# Altium project Portolan_Buck_Boost_V2.PrjPcb
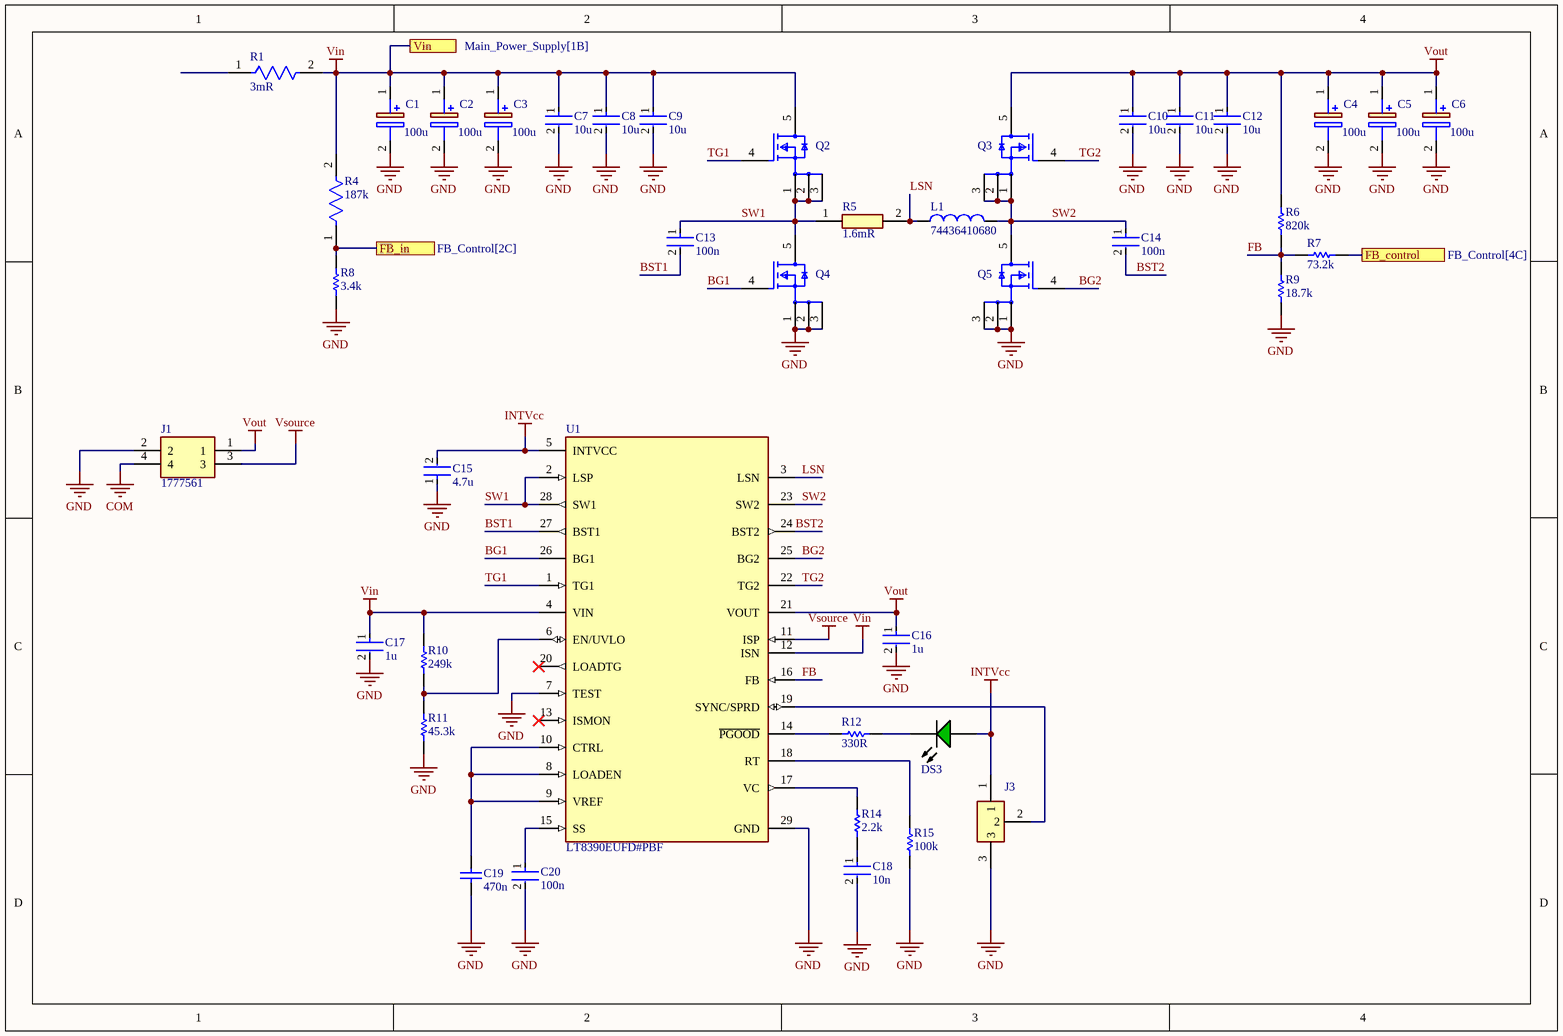
[diagram p0: Power_Stage.SchDoc]
3 sheets, 107 parts. Net scope: flat (ports and power ports of the same name join across sheets).
Board file: Buck_Boost_Converter.PcbDoc
Sheets:
  Power_Stage.SchDoc
  Main_Power_Supply.SchDoc
  FB_Control.SchDoc

## Sheet Power_Stage.SchDoc
size A4; SheetNumber: 1; SheetTotal: 3

### Parts
C1  value 100u  [CAPPRD500W65D1025H1700]  (hidden comment: ECA-2AM101B)
C2  value 100u  [CAPPRD500W65D1025H1700]  (hidden comment: ECA-2AM101B)
C3  value 100u  [CAPPRD500W65D1025H1700]  (hidden comment: ECA-2AM101B)
C4  value 100u  [CAPPRD500W65D1025H1700]  (hidden comment: ECA-2AM101B)
C5  value 100u  [CAPPRD500W65D1025H1700]  (hidden comment: ECA-2AM101B)
C6  value 100u  [CAPPRD500W65D1025H1700]  (hidden comment: ECA-2AM101B)
C7  10u  [FP-GRM32E-0_3-0_2-MFG]
C8  10u  [FP-GRM32E-0_3-0_2-MFG]
C9  10u  [FP-GRM32E-0_3-0_2-MFG]
C10  10u  [FP-GRM32E-0_3-0_2-MFG]
C11  10u  [FP-GRM32E-0_3-0_2-MFG]
C12  10u  [FP-GRM32E-0_3-0_2-MFG]
C13  100n  [FP-0805-L_2_01_0_2-W_1_25-MFG]
C14  100n  [FP-0805-L_2_01_0_2-W_1_25-MFG]
C15  4.7u  [FP-0805-L_2_01_0_2-W_1_25-IPC_A]
C16  1u  [FP-1210-L_3_3_0_4-W_2_5_0-IPC_C]
C17  1u  [FP-1210-L_3_3_0_4-W_2_5_0-IPC_C]
C18  10n  [FP-0805-L_2_01_0_2-W_1_25-IPC_B]
C19  470n  [CAPC2013X140X50ML20T25]
C20  100n  [FP-0805-L_2_01_0_2-W_1_25-MFG]
DS3  LTST-C170KGKT  [LTST-LTST-C170KGKT-2_V]  (value not drawn)
J1  1777561  [1777561]
J3  22-28-4030  [MOLEX_22-28-4030]  (value not drawn)
L1  74436410680  [WE-HCF_2815]
Q2  NVMYS3D3N06CLTWG  [FP-760AB-MFG]  (value not drawn)
Q3  NVMYS3D3N06CLTWG  [FP-760AB-MFG]  (value not drawn)
Q4  NVMYS3D3N06CLTWG  [FP-760AB-MFG]  (value not drawn)
Q5  NVMYS3D3N06CLTWG  [FP-760AB-MFG]  (value not drawn)
R1  3mR  [FP-CSS2H-3920K-3L00FE-MFG]
R4  187k  [FP-ERJ3EK-MFG]
R5  value 1.6mR  [RESC6432X89N]  (hidden comment: WSLP25121L600FEA)
R6  820k  [RESC1608X55X30ML15T15]
R7  73.2k  [RESC1005X40X25LL05T05]
R8  3.4k  [RESC1608X55X30LL15T15]
R9  18.7k  [RESC1608X55X30LL15T15]
R10  249k  [RESC1608X55X30ML15T15]
R11  45.3k  [RESC1608X55X30ML15T15]
R12  330R  [RESC1608X55X30LL15T15]
R14  2.2k  [RESC1608X55X30LL15T15]
R15  100k  [RESC1608X55X30ML15T15]
U1  LT8390EUFD#PBF  [FP-UFD-28-05-08-1712-MFG]

### Ports
FB_control (see FB_Control[4C]), FB_in (see FB_Control[2C]), Vin (see Main_Power_Supply[1B])

### Nets
COM: J1.4
GND: C1.2(-) C2.2(-) C3.2(-) C4.2(-) C5.2(-) C6.2(-) C7.2 C8.2 C9.2 C10.2 C11.2 C12.2 C15.1 C16.2 C17.2 C18.2 C19.1 C20.2 J1.2 J3.3 Q4.1(S) Q4.2(S) Q4.3(S) Q5.1(S) Q5.2(S) Q5.3(S) R8.1 R9.1 R11.1 R15.2 U1.7(TEST) U1.29(GND)
INTVcc: C15.2 DS3.2(A) J3.1 U1.5(INTVCC)
Vin: C1.1(+) C2.1(+) C3.1(+) C7.1 C8.1 C9.1 C17.1 Q2.5(D) R1.2 R4.2 R10.2 U1.4(VIN) U1.12(ISN) ; port Vin
Vout: C4.1(+) C5.1(+) C6.1(+) C10.1 C11.1 C12.1 C16.1 J1.1 Q3.5(D) R6.2 U1.21(VOUT)
Vsource: J1.3 U1.11(ISP)
BG1: Q4.4(G) U1.26(BG1)
BG2: Q5.4(G) U1.25(BG2)
BST1: C13.2 U1.27(BST1)
BST2: C14.2 U1.24(BST2)
FB: R6.1 R7.1 R9.2 U1.16(FB)
LSN: L1.1 R5.2 U1.3(LSN)
SW1: C13.1 Q2.1(S) Q2.2(S) Q2.3(S) Q4.5(D) R5.1 U1.2(LSP) U1.28(SW1)
SW2: C14.1 L1.2 Q3.1(S) Q3.2(S) Q3.3(S) Q5.5(D) U1.23(SW2)
TG1: Q2.4(G) U1.1(TG1)
TG2: Q3.4(G) U1.22(TG2)
NetC18_1: C18.1 R14.1
NetC19_2: C19.2 U1.8(LOADEN) U1.9(VREF) U1.10(CTRL)
NetC20_1: C20.1 U1.15(SS)
NetDS3_1: DS3.1(K) R12.1
NetJ3_2: J3.2 U1.19(SYNC/SPRD)
NetJ7_2: R7.2 ; port FB_control
NetR4_1: R4.1 R8.2 ; port FB_in
NetR10_1: R10.1 R11.2 U1.6(EN/UVLO)
NetR12_2: R12.2 U1.14(~{PGOOD})
NetR14_2: R14.2 U1.17(VC)
NetR15_1: R15.1 U1.18(RT)

Not connected (* = marked no-connect by the designer): R1 1; U1 13(ISMON)* 20(LOADTG)*

### Library data of the parts
C1-C6 = ECA-2AM101B: Aluminium Electrolytic Capacitors 100uF 100V - Radial Leaded Al Lytic Cap 85C Radial M Series; Manufacturer_Name: Panasonic; Datasheet Link: http://industrial.panasonic.com/cdbs/www-data/pdf/RDF0000/ABA0000C1218.pdf; Height: 17mm; Manufacturer_Part_Number: ECA-2AM101B; Mouser Part Number: 667-ECA-2AM101B; Mouser Price/Stock: https://www.mouser.co.uk/ProductDetail/Panasonic/ECA-2AM101B?qs=ncxkyCpAYDDPznZ5ZfVZ2w%3D%3D; Arrow Part Number: ECA-2AM101B; Arrow Price/Stock: https://www.arrow.com/en/products/eca-2am101b/panasonic?region=nac
C7-C12 = CMP-06035-000081-2: Chip Multilayer Ceramic Capacitors for General Purpose, 1210, 10uF, X7S, 22%, 10%, 100V; Case Code (Metric): 3225; Case/Package: 1210; Case Code (Imperial): 1210; Voltage Rating: 100V; Capacitance: 10uF; Packaging: Tape and Reel; Mount: Surface Mount; Min Operating Temperature: -55°C; Max Operating Temperature: 125°C; Tolerance: 10%
C13 C14 C20 = CMP-2000-05808-2: General Purpose Ceramic Capacitor, 0805, 100nF, 5%, X7R, 0.15, 50V; Dissipation Factor: 2.5%; Insulation Resistance: 100GR; Length: 2.01mm; Min Operating Temperature: -55°C; Number of Pins: 2; Width: 0.049inch; Height: 0.94mm; Max Operating Temperature: 125°C; RoHS Compliant: Yes; Depth: 1.25mm; Radiation Hardening: No; Case Code (Metric): 2012; Case/Package: 0805; Contact Plating: Tin; Mount: Surface Mount; Tolerance: 5%; Dielectric Material: Ceramic; Case Code (Imperial): 0805; Capacitance: 100nF; Dielectric: X7R; Voltage Rating: 50V; REACH SVHC: No SVHC; Thickness: 0.037inch; Voltage Rating (DC): 50V; Lead Free: Lead Free; Package Quantity: 1; Packaging: Tape and Reel; Voltage: 50V; Termination: SMD/SMT
C15 = CMP-1036-04881-3: General Purpose Ceramic Capacitor, 0805, 4.7uF, 10%, X5R, 0.15, 10V; Min Operating Temperature: -55°C; RoHS Compliant: Yes; Dielectric: X5R; Lead Free: Lead Free; Radiation Hardening: No; Depth: 1.25mm; Case Code (Metric): 2012; Weight: 0.000194oz; Packaging: Tape and Reel; Voltage Rating: 10V; Capacitance: 4.7uF; Number of Pins: 2; Voltage: 10V; Construction: Flat; Length: 2.01mm; Case Code (Imperial): 0805; Package Quantity: 1; Voltage Rating (DC): 10V; Height: 1.4mm; Termination: SMD/SMT; Tolerance: 10%; REACH SVHC: No SVHC; Mount: Surface Mount; Width: 1.25mm; Max Operating Temperature: 85°C; Case/Package: 0805; Series: -; Thickness: 0.055inch
C16 C17 = CMP-2000-05475-2: General Purpose Ceramic Capacitor, 1210, 1uF, 10%, X7R, 15%, 100V; Tolerance: 20%; Dissipation Factor: 2.5%; Voltage Rating (DC): 100V; Series: -; Voltage Rating: 100V; Max Operating Temperature: 125°C; Radiation Hardening: No; Length: 3.2mm; Mount: Surface Mount; Termination: SMD/SMT; Voltage: 100V; RoHS Compliant: Yes; Case/Package: 1210; Thickness: 0.11inch; REACH SVHC: No SVHC; Lead Free: Lead Free; Height: 2.79mm; Case Code (Imperial): 1210; Contact Plating: Tin; Case Code (Metric): 3225; Min Operating Temperature: -55°C; Construction: Flat; Capacitance: 1uF; Depth: 2.5mm; Dielectric: X7R; Package Quantity: 1; Packaging: Tape and Reel; Width: 2.5mm
C18 = CMP-2007-04361-2: General Purpose Ceramic Capacitor, 0805, 10nF, 5%, X7R, 0.15, 50V; Insulation Resistance: 100GR; Dissipation Factor: 2.5%; Series: -; Case Code (Imperial): 0805; Voltage Rating (DC): 50V; Dielectric: X7R; Voltage Rating: 50V; Lead Free: Lead Free; Max Operating Temperature: 125°C; Depth: 1.25mm; Termination: SMD/SMT; Number of Pins: 2; Dielectric Material: Ceramic; Capacitance: 10nF; Case/Package: 0805; Contact Plating: Tin; Mount: Surface Mount; Height: 0.71mm; Package Quantity: 1; Packaging: Tape and Reel; Construction: Flat; RoHS Compliant: Yes; Voltage: 50V; Case Code (Metric): 2012; REACH SVHC: No SVHC; Tolerance: 5%; Radiation Hardening: No; Width: 0.049inch; Thickness: 0.037inch; Length: 2.01mm; Min Operating Temperature: -55°C
C19 = CMP-2007-04634-1: Manufacturer: AVX Interconnect / Elco; Part Number: 08055C474JAT2A
DS3 = CMP-2000-06620-1: Ultra Bright AlInGaP Chip LED, 75 mW, -55 to 85 degC, 2-Pin SMD (0805), RoHS, Tape and Reel; Manufacturer: Lite-On; Forward Current: 30mA; Power Dissipation Max: 75mW; Emitting Color: YellowGreen; Type: Uni-Color; Forward Voltage: 2.4V; Dominant Wave Length: 571nm; Test Current (It): 20mA; Product Length (mm): 2mm; Peak Wavelength: 574nm; Power Dissipation: 75W; Product Depth (mm): 1.25mm; DELETED: Compliant; High Brightness: Yes; Product Height (mm): 1.1mm; Luminous Intensity: 35mcd; Shape Type: Rectangular; Chip Material: AlGaInP; Viewing Angle: 130deg; Number of  Elements: 1; Reverse Voltage: 5V; Rad Hardened: No; Package Type: ChipLed; Manufacturer URL: http://www.us.liteon.com/; Mounting: SurfaceMount; Operating Temp Range: -55Cto85C; Datasheet URL: http://optoelectronics.liteon.com/upload/download/DS22-2000-073/S_110_LTST-C170KGKT.pdf; Packaging: TapeandReel; Pin Count: 2; Package Description: 2-Pin Surface Mounted Device, Body 2 x 1.25 mm; Mounting Technology: SurfaceMount; Package Reference: LTST-C170KGKT-2; Forward Current Max: 30mA; Datasheet Version: Rev. G, 06/2005; Lens Dimensions: 1.4x1.25x0.6mm; Operating Temperature Classification: Industrial; Lum Intensity: 35mcd; Main Category: ChipLED
J1 = 1777561: Connector; Manufacturer_Name: Phoenix Contact; Datasheet Link: https://www.digikey.com/en/products/detail/phoenix-contact/1777561/4453071?s=N4IgTCBcDaIIwHYkFYBscQF0C%2BQ; Height: 27.2mm; Manufacturer_Part_Number: 1777561; Mouser Part Number: 651-1777561; Mouser Price/Stock: https://www.mouser.co.uk/ProductDetail/Phoenix-Contact/1777561?qs=eS454NpRRZHLxN8tVDEUWQ%3D%3D; Arrow Part Number: 1777561; Arrow Price/Stock: https://www.arrow.com/en/products/1777561/phoenix-contact?region=nac
J3 = 22-28-4030: Connector Header Through Hole 3 position 0.100" (2.54mm); Package: None; Price: None; Value: *; MP: 22-28-4030; Availability: Unavailable
L1 = CMP-03913-84285494-2: 74436410680 Inductor, high current, 6.8uH, 1.44mOhm, 27mmL x 28mmW x 15.4mmH, SMT; Inductance: 6.8µH; Saturation Current: 30A; DC Resistance (DCR): 1.31mΩ; Inductance Tolerance: 15%; Ambient Temperature Range High: 75°C; Length: 27mm; NexarPartId: 84285494; Height: 15.4mm; Min Operating Temperature: -40°C; Ambient Temperature Range Low: -40°C; Max Operating Temperature: 125°C; Number of Pins: 2; RoHS: Compliant; Width: 28mm
Q2-Q5 = CMP-00278-99684032-1: NVMYS3D3N06CLTWG Single Mosfet Transistors Rohs Compliant: Yes; Manufacturer Lifecycle Status: ACTIVE; Turn-On Delay Time: 15ns; Drain to Source Resistance: 2.6mΩ; Gate to Source Voltage (Vgs): 20V; Number of Channels: 1; Max Junction Temperature (Tj): 175°C; Drain to Source Breakdown Voltage: 60V; Turn-Off Delay Time: 66ns; Continuous Drain Current (ID): 26A; Power Dissipation: 3.9W; NexarPartId: 99684032; Min Operating Temperature: -55°C; RoHS: Compliant; Drain to Source Voltage (Vdss): 60V; Lifecycle Status: Production; Max Operating Temperature: 175°C; Height: 1.3mm
R1 = CMP-07231-007409-1: RES 0.003 OHM 1% 5W 3920; Temperature Coefficient: 50ppm/°C; Max Power Dissipation: 5W; Resistor Type: Metal Element; RoHS Compliant: Yes; Case/Package: 3920; Tolerance: 1%; Packaging: Tape and Reel; Features: Moisture Resistant; Series: CSS2H-3920; Resistance: 3mR; Min Operating Temperature: -55°C; Number of Terminations: 2; Max Operating Temperature: 170°C
R4 = CMP-2000-00305-2: RES SMD 187K OHM 1% 1/10W 0603; Temperature Coefficient: 100ppm/°C; Max Power Dissipation: 100mW; Voltage Rating (DC): 50V; Resistance: 187kR; Voltage Rating: 75V; Packaging: Tape and Reel; Height: 0.45mm; Mount: Surface Mount; Min Operating Temperature: -55°C; Contact Plating: Tin; Radiation Hardening: No; Case/Package: 0603; Technology: THICK FILM; Resistor Type: Thick Film; Features: Automotive AEC-Q200; Length: 1.6mm; REACH SVHC: Yes; Construction: Rectangular; Max Operating Temperature: 155°C; Military Standard: Not; Case Code (Imperial): 0603; RoHS Compliant: Yes; Package Quantity: 1; Power Rating: 100mW; Termination: SMD/SMT; Resistance Tolerance: 1%; Number of Terminations: 2; Case Code (Metric): 1608; Depth: 0.8mm; Series: ERJ; Tolerance: 1%; Width: 0.8mm; Lead Free: Lead Free
R5 = WSLP25121L600FEA: Current Sense Resistors - SMD 3watt .0016ohm 1%; Manufacturer_Name: Vishay; Datasheet Link: https://www.vishay.com/docs/30122/wslp.pdf; Height: 0.889mm; Manufacturer_Part_Number: WSLP25121L600FEA
R6 = CMP-2000-00657-1: Manufacturer: Panasonic; Part Number: ERJ3EKF8203V
R7 = CMP-2002-01054-1: Part Number: ERJ-2RKF7322X; Manufacturer: Panasonic
R8 = CMP-2000-00446-1: Part Number: ERJ-3EKF3401V; Manufacturer: Panasonic
R9 = CMP-2000-00304-1: Part Number: ERJ-3EKF1872V; Manufacturer: Panasonic
R10 = CMP-2000-00371-1: Part Number: ERJ-3EKF2493V; Manufacturer: Panasonic
R11 = CMP-1012-00697-2: Manufacturer: Panasonic; Part Number: ERJ-3EKF4532V
R12 = CMP-2000-00435-2: Chip Resistor, 330 Ohm, +/- 1%, 0.1 W, -55 to 155 degC, 0603 (1608 Metric), RoHS, Tape and Reel; Gender: Male; Mating Cycles: 10000; Current Rating: 500 mA; Voltage Rating: 10 V; REACH SVHC: No SVHC; PackageDescription: 2-Pin Surface Mount Device, Body 1.6 x 0.85 mm; Contact Finish: Gold; Pins: 8; ComponentLink1Description: Manufacturer URL; Packaging: Tape and Reel; Max Operating Temperature: 85 degC; Contact Material: Copper; Height: 1.45 mm; Width: 1.45 mm; DatasheetVersion: Apr-15; Package Quantity: 1500; Contact Plating: Gold; PackageReference: 0603; Mount: Surface Mount; Lead Pitch: 1.1 mm; Min Operating Temperature: -25 degC; ComponentLink1URL: http://www.panasonic.com/; ComponentLink2URL: http://industrial.panasonic.com/cdbs/www-data/pdf/RDA0000/AOA0000C86.pdf; Length: 13.7 mm; ComponentLink2Description: Datasheet; RoHSCompliant: true
R14 = CMP-2000-00336-1: Part Number: ERJ3EKF2201V; Manufacturer: Panasonic
R15 = CMP-2000-00182-1: Part Number: ERJ-3EKF1003V; Manufacturer: Panasonic
U1 = CMP-09139-000027-1: IC REG CTRLR BUCK/BOOST 28QFN; Number of Output Phases: 1; Max Supply Voltage: 60V; Min Supply Voltage: 4V; Switching Frequency: 630kHz; Synchronous Rectifier: Yes; Topology: Buck-Boost; Max Duty Cycle: 95%; Output Configuration: Positive; Case/Package: QFN; Min Operating Temperature: -40°C; REACH SVHC: No SVHC; Number of Pins: 28; Max Operating Temperature: 125°C; Clock Sync: Yes; Number of Outputs: 1

## Sheet Main_Power_Supply.SchDoc
size A4; SheetNumber: 2; SheetTotal: 3
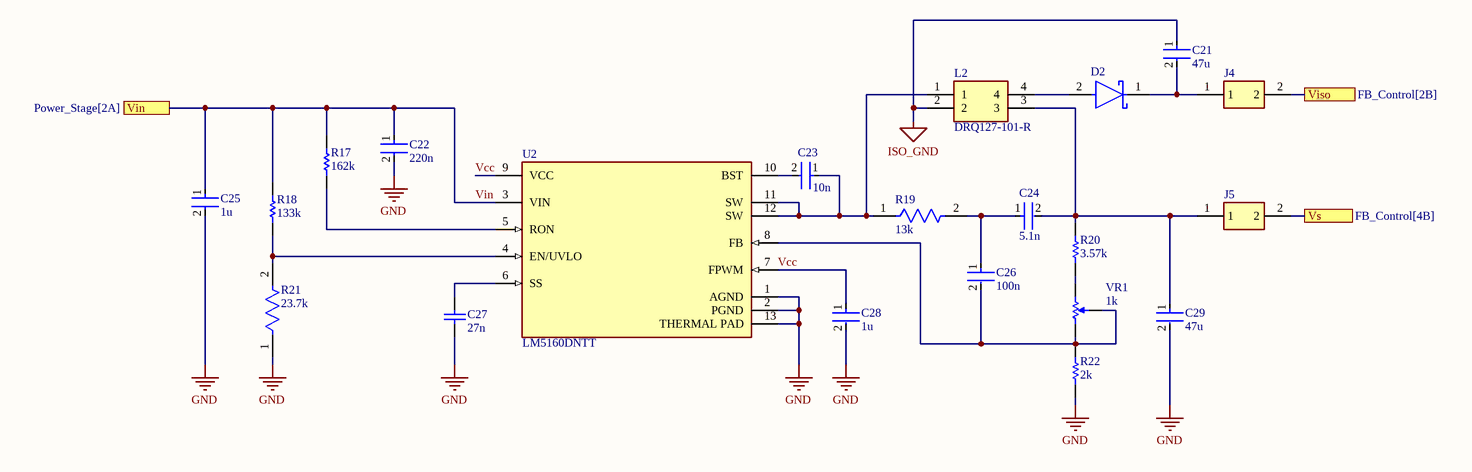
[diagram p1: Main_Power_Supply.SchDoc]

### Parts
C21  47u  [FP-GRM32E-0_3-0_2-IPC_A]
C22  220n  [FP-GRM21A-0_1-MFG]
C23  10n  [FP-0805-L_2_01_0_2-W_1_25-IPC_B]
C24  5.1n  [FP-GRM219-0_1-IPC_A]
C25  1u  [FP-1210-L_3_3_0_4-W_2_5_0-IPC_C]
C26  100n  [FP-0805-L_2_01_0_2-W_1_25-MFG]
C27  27n  [CAPC1005X56X25LL10T15]
C28  1u  [FP-1210-L_3_3_0_4-W_2_5_0-IPC_C]
C29  47u  [FP-GRM32E-0_3-0_2-IPC_A]
D2  MBR230LSFT1G  [FP-498-MFG]  (value not drawn)
J4  22-28-4020  [MOLEX_22-28-4020]  (value not drawn)
J5  22-28-4020  [MOLEX_22-28-4020]  (value not drawn)
L2  DRQ127-101-R  [DRQ127101R]
R17  162k  [RESC1608X55X30ML15T15]
R18  133k  [RESC1608X55X30LL15T15]
R19  13k  [FP-ERJ3EK-IPC_C]
R20  3.57k  [RESC1608X55X30LL15T15]
R21  23.7k  [FP-ERJ3EK-IPC_C]
R22  2k  [RESC1608X55X30ML15T15]
U2  LM5160DNTT  [FP-DNT0012B-MFG]
VR1  1k  [BOUR-3296W-1-3]

### Ports
Vin (see Power_Stage[2A]), Viso (see FB_Control[2B]), Vs (see FB_Control[4B])

### Nets
GND: C22.2 C25.2 C27.1 C28.2 C29.2 R21.1 R22.1 U2.1(AGND) U2.2(PGND) U2.13(THERMAL_PAD)
ISO_GND: C21.1 L2.2
Vin: C22.1 C25.1 R17.2 R18.2 U2.3(VIN) ; port Vin
Viso: J4.2 ; port Viso
Vs: J5.2 ; port Vs
Vcc: C28.1 U2.7(FPWM) U2.9(VCC)
NetC21_2: C21.2 D2.1(C) J4.1
NetC23_1: C23.1 L2.1 R19.1 U2.11(SW) U2.12(SW)
NetC23_2: C23.2 U2.10(BST)
NetC24_1: C24.1 C26.1 R19.2
NetC24_2: C24.2 C29.1 J5.1 L2.3 R20.2
NetC26_2: C26.2 R22.2 U2.8(FB) VR1.1(A) VR1.3(TAP)
NetC27_2: C27.2 U2.6(SS)
NetD2_2: D2.2(A) L2.4
NetR17_1: R17.1 U2.5(RON)
NetR18_1: R18.1 R21.2 U2.4(EN/UVLO)
NetR20_1: R20.1 VR1.2(B)

### Library data of the parts
C21 C29 = CMP-06035-017875-1: Chip Multilayer Ceramic Capacitors for General Purpose, 1210, 47uF, X6S, 22%, 10%, 16V; Thickness: 2.5mm; Capacitance: 47uF; Length: 3.2mm; Dielectric: X6S; Width: 2.5mm; Case/Package: 1210; Tolerance: 10%; Voltage Rating (DC): 16V
C22 = CMP-1036-04561-4: CAP CER 0.22UF 100V X7R 0805; Material: Ceramic; Tolerance: 10%; Capacitance: 220nF; Radiation Hardening: No; Case Code (Imperial): 0805; Height: 1mm; Length: 2mm; Case/Package: 0805; Packaging: Tape and Reel; Case Code (Metric): 2012; Thickness: 0.039inch; Voltage Rating (DC): 100V; Width: 1.25mm; Max Operating Temperature: 125°C; Voltage: 100V; Dielectric: X7R; Mount: Surface Mount; Package Quantity: 3000; Voltage Rating: 100V; REACH SVHC: No SVHC; Depth: 1.25mm; Min Operating Temperature: -55°C; Termination: SMD/SMT; Lead Free: Lead Free
C23 = CMP-2007-04361-2: as C18 on sheet Power_Stage; Series: -; Case Code (Imperial): 0805; Voltage Rating (DC): 50V; Dielectric: X7R; Voltage Rating: 50V; Lead Free: Lead Free; Max Operating Temperature: 125°C; Depth: 1.25mm; Termination: SMD/SMT; Number of Pins: 2; Dielectric Material: Ceramic; Capacitance: 10nF; Case/Package: 0805; Contact Plating: Tin; Mount: Surface Mount; Height: 0.71mm; Package Quantity: 1; Packaging: Tape and Reel; Construction: Flat; RoHS Compliant: Yes; Voltage: 50V; Case Code (Metric): 2012; REACH SVHC: No SVHC; Tolerance: 5%; Radiation Hardening: No; Width: 0.049inch; Thickness: 0.037inch; Length: 2.01mm; Min Operating Temperature: -55°C
C24 = CMP-2007-00142-2: Chip Multilayer Ceramic Capacitors for General Purpose, 0805, 5100pF, C0G, 30ppm/°C, 5%, 50V; Capacitance: 5.1nF; Min Operating Temperature: -55°C; Voltage Rating (DC): 50V; Radiation Hardening: No; Case/Package: 0805; Depth: 1.25mm; Case Code (Imperial): 0805; Voltage: 50V; Lead Free: Lead Free; Mount: Surface Mount; Packaging: Tape and Reel; Width: 0.049inch; Height: 0.85mm; Length: 2mm; Voltage Rating: 50V; Thickness: 0.037inch; Package Quantity: 1; Tolerance: 5%; Max Operating Temperature: 125°C; Case Code (Metric): 2012; Termination: SMD/SMT; Dielectric: C0G
C25 C28 = CMP-2000-05475-2: as C16 on sheet Power_Stage; Voltage Rating (DC): 100V; Series: -; Voltage Rating: 100V; Max Operating Temperature: 125°C; Radiation Hardening: No; Length: 3.2mm; Mount: Surface Mount; Termination: SMD/SMT; Voltage: 100V; RoHS Compliant: Yes; Case/Package: 1210; Thickness: 0.11inch; REACH SVHC: No SVHC; Lead Free: Lead Free; Height: 2.79mm; Case Code (Imperial): 1210; Contact Plating: Tin; Case Code (Metric): 3225; Min Operating Temperature: -55°C; Construction: Flat; Capacitance: 1uF; Depth: 2.5mm; Dielectric: X7R; Package Quantity: 1; Packaging: Tape and Reel; Width: 2.5mm
C26 = CMP-2000-05808-2: as C13 on sheet Power_Stage; Length: 2.01mm; Min Operating Temperature: -55°C; Number of Pins: 2; Width: 0.049inch; Height: 0.94mm; Max Operating Temperature: 125°C; RoHS Compliant: Yes; Depth: 1.25mm; Radiation Hardening: No; Case Code (Metric): 2012; Case/Package: 0805; Contact Plating: Tin; Mount: Surface Mount; Tolerance: 5%; Dielectric Material: Ceramic; Case Code (Imperial): 0805; Capacitance: 100nF; Dielectric: X7R; Voltage Rating: 50V; REACH SVHC: No SVHC; Thickness: 0.037inch; Voltage Rating (DC): 50V; Lead Free: Lead Free; Package Quantity: 1; Packaging: Tape and Reel; Voltage: 50V; Termination: SMD/SMT
C27 = CMP-2008-02846-1: Part Number: 0402YD273KAT2A; Manufacturer: AVX Interconnect / Elco
D2 = CMP-1055-00442-2: DIODE SCHOTTKY 30V 2A SOD123L; Max Forward Surge Current (Ifsm): 40A; Element Configuration: Single; Forward Voltage: 430mV; Peak Reverse Current: 1mA; Max Reverse Voltage (DC): 30V; Max Operating Temperature: 125°C; Max Repetitive Reverse Voltage (Vrrm): 30V; Forward Current: 2A; Package Quantity: 1; Height: 0.9mm; REACH SVHC: No SVHC; Contact Plating: Tin; Min Operating Temperature: -55°C; Lead Free: Lead Free; Average Rectified Current: 2A; Halogen Free: Halogen Free; Peak Non-Repetitive Surge Current: 40A; Radiation Hardening: No; Case/Package: SOD; Number of Pins: 2; Packaging: Tape and Reel; Width: 1.8mm; Length: 2.9mm
J4 J5 = 22-28-4020: Connector Header Through Hole 2 position 0.100 (2.54mm); MF: Molex; MP: 22-28-4020; Purchase-URL: https://pricing.snapeda.com/search/part/22-28-4020/?ref=eda; Availability: In Stock; SnapEDA_Link: https://www.snapeda.com/parts/22-28-4020/Molex/view-part/?ref=snap; Package: None; Check_prices: https://www.snapeda.com/parts/22-28-4020/Molex/view-part/?ref=eda; Value: *; Price: None
L2 = DRQ127-101-R: Inductor; Manufacturer_Name: Eaton; Datasheet Link: https://www.eaton.com/content/dam/eaton/products/electronic-components/resources/data-sheet/eaton-drq-shielded-drum-core-power-inductors-data-sheet.pdf; Height: 8mm; Manufacturer_Part_Number: DRQ127-101-R; Mouser Part Number: 704-DRQ127-101-R; Mouser Price/Stock: https://www.mouser.co.uk/ProductDetail/Coiltronics-Eaton/DRQ127-101-R?qs=yzwxPInThYRNK3mQinvZTQ%3D%3D; Arrow Part Number: DRQ127-101-R; Arrow Price/Stock: https://www.arrow.com/en/products/drq127-101-r/eaton
R17 = CMP-1012-00758-2: Manufacturer: Panasonic; Part Number: ERJ-3EKF1623V
R18 = CMP-2000-00239-1: Manufacturer: Panasonic; Part Number: ERJ-3EKF1333V
R19 = CMP-2000-00233-2: RES SMD 13K OHM 1% 1/10W 0603; Voltage Rating (DC): 50V; Max Power Dissipation: 100mW; Voltage Rating: 75V; Resistance: 13kR; Temperature Coefficient: 100ppm/°C; REACH SVHC: No SVHC; Contact Plating: Tin; Case/Package: 0603; Length: 1.6mm; Case Code (Metric): 1608; Construction: Rectangular; Case Code (Imperial): 0603; Termination: SMD/SMT; Power Rating: 100mW; Weight: 7.1E-05oz; Package Quantity: 1; Packaging: Tape and Reel; Mount: Surface Mount; Resistance Tolerance: 1%; Width: 0.031inch; Tolerance: 1%; Max Operating Temperature: 155°C; Features: Automotive AEC-Q200; Height: 0.45mm; Number of Terminations: 2; Series: ERJ; Military Standard: Not; Resistor Type: Thick Film; Min Operating Temperature: -55°C; Lead Free: Lead Free; Depth: 0.8mm; Technology: THICK FILM; RoHS Compliant: Yes; Radiation Hardening: No
R20 = CMP-1012-00571-2: Part Number: ERJ-3EKF3571V; Manufacturer: Panasonic
R21 = CMP-2000-00357-6: RES SMD 23.7K OHM 1% 1/10W 0603; Voltage Rating: 75V; Power Rating: 100mW; Temperature Coefficient: 100ppm/°C; Voltage Rating (DC): 50V; Resistance: 23.7kR; Packaging: Tape and Reel; Width: 0.8mm; Height: 0.022inch; Construction: Rectangular; Contact Plating: Tin; Mount: Surface Mount; Max Operating Temperature: 155°C; Case/Package: 0603; Termination: SMD/SMT; Depth: 0.8mm; Tolerance: 1%; Weight: 7.1E-05oz; Military Standard: Not; RoHS Compliant: Yes; Min Operating Temperature: -55°C; Series: ERJ; Max Power Dissipation: 100mW; Length: 0.063inch; Case Code (Imperial): 0603; Resistance Tolerance: 1%; Number of Terminations: 2; Resistor Type: Thick Film; Package Quantity: 5000; Case Code (Metric): 1608; Lead Free: Lead Free; Radiation Hardening: No; Features: Automotive AEC-Q200
R22 = CMP-2000-00317-1: Part Number: ERJ-3EKF2001V; Manufacturer: Panasonic
U2 = CMP-04918-000448-1: IC REG BCK FLYBCK ADJ 12WSON; Min Input Voltage: 4.5V; Operating Supply Current: 2.3mA; Output Current: 1.5A; Number of Outputs: 1; Topology: Flyback; Synchronous Rectifier: Yes; Output Type: Adjustable; Max Input Voltage: 65V; Min Output Voltage: 2V; Switching Frequency: 1MHz; Output Voltage: 60V; Mount: Surface Mount; Min Operating Temperature: -40°C; Package Quantity: 250; Min Supply Voltage: 4.5V; Max Operating Temperature: 125°C; RoHS Compliant: Yes; Contact Plating: Tin; Height: 0.8mm; Packaging: Tape and Reel; Quiescent Current: 2.3mA; Lead Free: Lead Free; Number of Pins: 12; Max Output Current: 1.5A; REACH SVHC: No SVHC; Width: 4mm; Operating Supply Voltage: 65V; Max Output Voltage: 60V; Length: 4mm
VR1 = CMP-1747-00002-1: Square Trimpot(R) Trimming Potentiometer, 1000 Ohm, -55 to 125 degC, 3-Pin THD, RoHS, Tube; Case\Package: 0603; Tolerance: 1%; Power Rating: 100 mW; Voltage Rating: 75 V; Resistance: 4.7 kohm; ComponentLink2URL: http://www.bourns.com/docs/Product-Datasheets/3296.pdf; Packaging: Tape and Reel; REACH SVHC: Yes; ComponentLink1URL: http://www.bourns.com/; Case Code (Metric): 1608; Width: 0.8 mm; ComponentLink1Description: Manufacturer URL; DatasheetVersion: May-16; Max Operating Temperature: 155 degC; PackageReference: 3296W-1-3; PackageDescription: 3-Pin Through Hole Device, Body 9.53 x 4.83 mm, Pitch 2.54 mm; Weight: 7.1E-05 oz; ComponentLink2Description: Datasheet; RoHSCompliant: true; Min Operating Temperature: -55 degC; Radiation Hardening: No; Case Code (Imperial): 0603; Length: 1.6 mm; Package Quantity: 5000; Pins: 2; Mount: Surface Mount; Height: 0.45 mm

## Sheet FB_Control.SchDoc
size A4; SheetNumber: 3; SheetTotal: 3
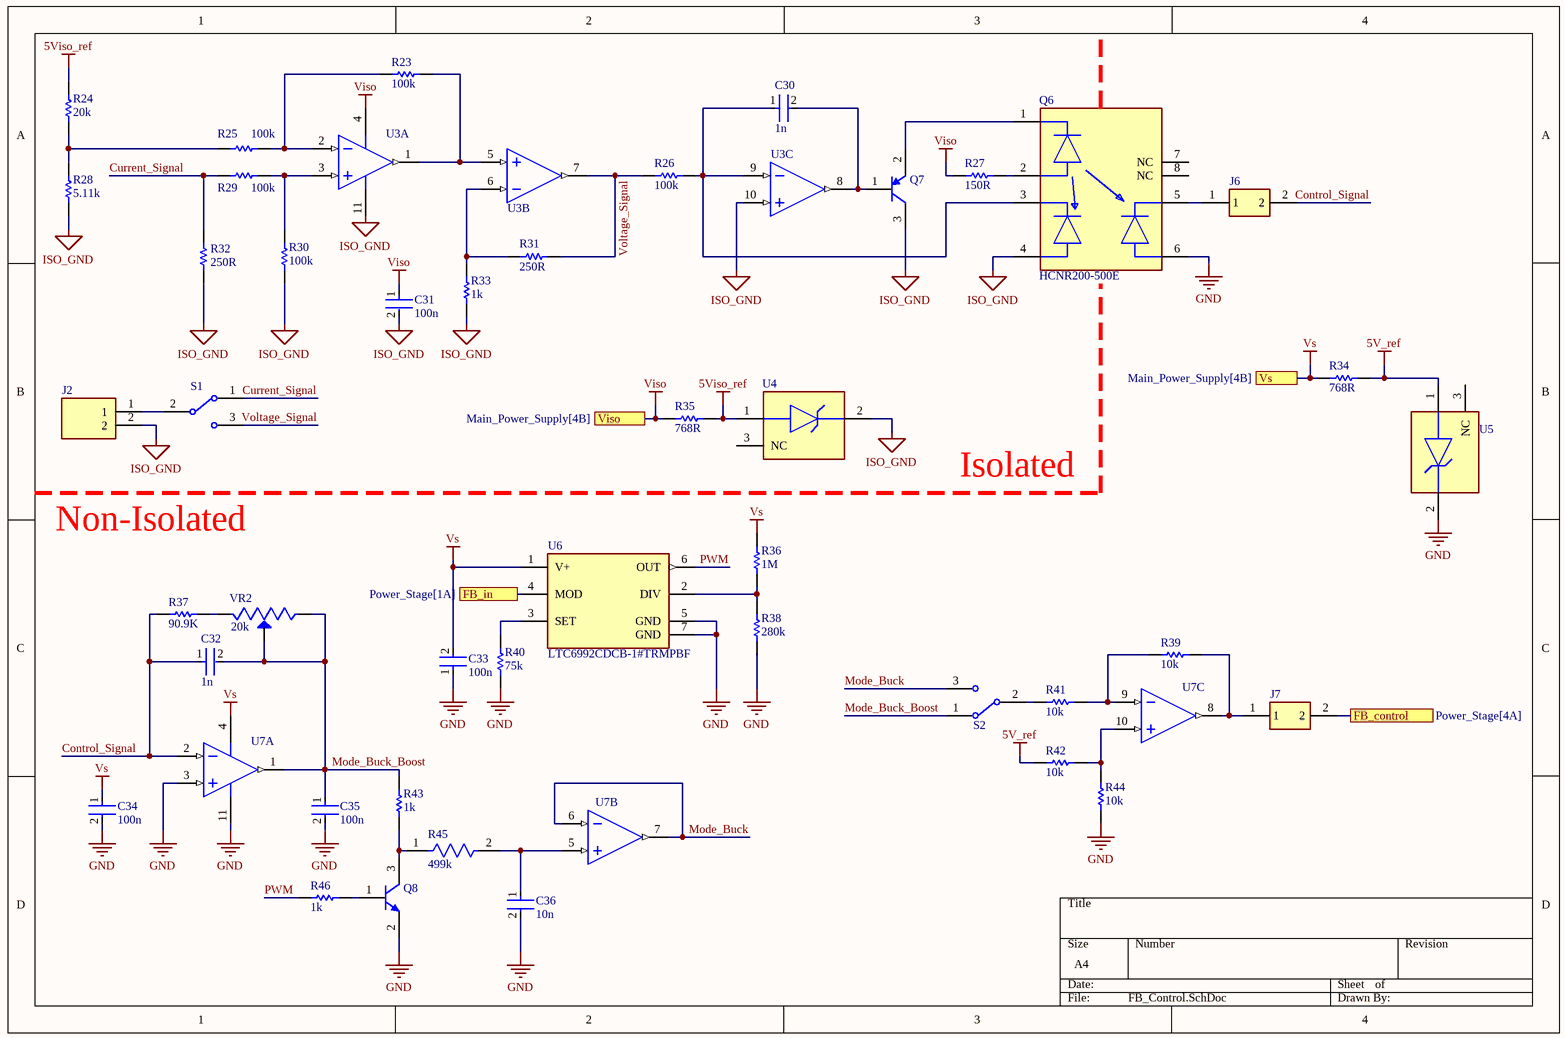
[diagram p2: FB_Control.SchDoc]

### Parts
C30  1n  [FP-1206-L_3_2_0_2-W_1_6_0-IPC_C]
C31  100n  [FP-0805-L_2_01_0_2-W_1_25-MFG]
C32  1n  [FP-1206-L_3_2_0_2-W_1_6_0-IPC_C]
C33  100n  [FP-0805-L_2_01_0_2-W_1_25-MFG]
C34  100n  [FP-0805-L_2_01_0_2-W_1_25-MFG]
C35  100n  [FP-0805-L_2_01_0_2-W_1_25-MFG]
C36  10n  [FP-0805-L_2_01_0_2-W_1_25-IPC_B]
J2  TB001-500-02BE  [TB00150002BE]  (value not drawn)
J6  22-28-4020  [MOLEX_22-28-4020]  (value not drawn)
J7  22-28-4020  [MOLEX_22-28-4020]  (value not drawn)
Q6  HCNR200-500E  [FP-HCNR200-500E-MFG]
Q7  MMBT3906TT1G  [ONSC-SC-75-3-463-01_V]  (value not drawn)
Q8  MMBT3904LT1G  [ONSC-SOT-23-3-318-08_V]  (value not drawn)
R23  100k  [RESC1608X55X30ML15T15]
R24  20k  [RESC1608X55X30ML15T15]
R25  100k  [RESC1608X55X30ML15T15]
R26  100k  [RESC1608X55X30ML15T15]
R27  150R  [RESC1608X55X30NL15T15]
R28  5.11k  [RESC1608X55X30LL15T15]
R29  100k  [RESC1608X55X30ML15T15]
R30  100k  [RESC1608X55X30ML15T15]
R31  250R  [RESC1608X55N]
R32  250R  [RESC1608X55N]
R33  1k  [RESC1608X55X30LL15T15]
R34  768R  [RESC1608X55X30LL15T15]
R35  768R  [RESC1608X55X30LL15T15]
R36  1M  [RESC1608X55X25LL10T15]
R37  90.9K  [RESC1608X55X30ML15T15]
R38  280k  [RESC1608X55X30LL15T15]
R39  10k  [RESC1609X55X30LL15T15]
R40  75k  [RESC1608X55X30NL15T15]
R41  10k  [RESC1609X55X30LL15T15]
R42  10k  [RESC1609X55X30LL15T15]
R43  1k  [RESC1608X55X30LL15T15]
R44  10k  [RESC1609X55X30LL15T15]
R45  499k  [FP-ERJ3EK-IPC_B]
R46  1k  [RESC1608X55X30LL15T15]
S1  100SP1T1B1M2QEH  [100SP1T1B4M2QE]  (value not drawn)
S2  100SP1T1B1M2QEH  [100SP1T1B4M2QE]  (value not drawn)
U3  AD8534ARUZ-REEL  [ADI-RU-14_L]  (value not drawn)  (parts A,B,C of 4)
U4  LM4040CYM3-5.0-TR  [FP-SOT23-3LD-PL-1-MFG]  (value not drawn)
U5  LM4040CYM3-5.0-TR  [FP-SOT23-3LD-PL-1-MFG]  (value not drawn)
U6  LTC6992CDCB-1#TRMPBF  [FP-DCB-6-05-08-1715-MFG]
U7  AD8534ARUZ-REEL  [ADI-RU-14_L]  (value not drawn)  (parts A,B,C of 4)
VR2  value 20k  [TRIM_3296W-1-203LF]  (hidden comment: 3296W-1-203LF)

### Ports
FB_control (see Power_Stage[4A]), FB_in (see Power_Stage[1A]), Viso (see Main_Power_Supply[4B]), Vs (see Main_Power_Supply[4B])

### Nets
5V_ref: R34.2 R42.2 U5.1(A)
5Viso_ref: R24.2 R35.2 U4.1(A)
GND: C33.1 C34.2 C35.2 C36.2 Q6.6(PD2_CATHODE) Q8.2(E) R38.1 R40.1 R44.2 U5.2(C) U6.5(GND) U6.7(GND) U7.3(+IN_A) U7.11(V-)
ISO_GND: C31.2 J2.2 Q6.4(PD1_ANODE) Q7.3(C) R28.1 R30.1 R32.1 R33.1 U3.10(+IN_C) U3.11(V-) U4.2(C)
Viso: C31.1 R27.1 R35.1 U3.4(V+) ; port Viso
Vs: C33.2 C34.1 R34.1 R36.2 U6.1(V+) U7.4(V+) ; port Vs
Control_Signal: C32.1 J6.2 R37.1 U7.2(-IN_A)
Current_Signal: R29.1 R32.2 S1.1(NC)
Mode_Buck: S2.3(NO) U7.6(-IN_B) U7.7(OUT_B)
Mode_Buck_Boost: C32.2 C35.1 R43.2 S2.1(NC) U7.1(OUT_A) VR2.1(CCW) VR2.2(WIPER)
PWM: R46.1 U6.6(OUT)
Voltage_Signal: R26.1 R31.1 S1.3(NO) U3.7(OUT_B)
NetC30_1: C30.1 Q6.3(PD1_CATHODE) R26.2 U3.9(-IN_C)
NetC30_2: C30.2 Q7.1(B) U3.8(OUT_C)
NetC36_1: C36.1 R45.2 U7.5(+IN_B)
NetJ2_1: J2.1 S1.2(COM)
NetJ6_1: J6.1 Q6.5(PD2_ANODE)
NetJ7_1: J7.1 R39.1 U7.8(OUT_C)
NetJ7_2: J7.2 ; port FB_control
NetQ6_1: Q6.1(LED_CATHODE) Q7.2(E)
NetQ6_2: Q6.2(LED_ANODE) R27.2
NetQ8_1: Q8.1(B) R46.2
NetQ8_3: Q8.3(C) R43.1 R45.1
NetR4_1: U6.4(MOD) ; port FB_in
NetR23_1: R23.1 R25.2 U3.2(-IN_A)
NetR23_2: R23.2 U3.1(OUT_A) U3.5(+IN_B)
NetR24_1: R24.1 R25.1 R28.2
NetR29_2: R29.2 R30.2 U3.3(+IN_A)
NetR31_2: R31.2 R33.2 U3.6(-IN_B)
NetR36_1: R36.1 R38.2 U6.2(DIV)
NetR37_2: R37.2 VR2.3(CW)
NetR39_2: R39.2 R41.1 U7.9(-IN_C)
NetR40_2: R40.2 U6.3(SET)
NetR41_2: R41.2 S2.2(COM)
NetR42_1: R42.1 R44.1 U7.10(+IN_C)

Not connected (* = marked no-connect by the designer): Q6 7(NC) 8(NC); U4 3(NC); U5 3(NC)

### Notes on the sheet
- Isolated
- Non-Isolated

### Library data of the parts
C30 C32 = CMP-2000-05856-2: General Purpose Ceramic Capacitor, 1206, 1nF, 5%, NP0, 30ppm/°C, 100V; Dielectric: C0G; Dissipation Factor: 2.5%; Insulation Resistance: 100GR; Min Operating Temperature: -55°C; Capacitance: 1nF; Construction: Flat; Radiation Hardening: No; Voltage Rating (DC): 100V; Depth: 1.6mm; Series: -; Case Code (Metric): 3216; Temperature Coefficient: 30ppm/°C; RoHS Compliant: Yes; Max Operating Temperature: 125°C; Voltage Rating: 100V; Width: 1.6mm; Voltage: 100V; REACH SVHC: No SVHC; Packaging: Tape and Reel; Lead Free: Lead Free; Number of Pins: 2; Mount: Surface Mount; Tolerance: 5%; Height: 0.5mm; Size: 0.94mm; Package Quantity: 1; Termination: SMD/SMT; Length: 3.2mm; Contact Plating: Tin; Case Code (Imperial): 1206; Thickness: 0.037inch; Case/Package: 1206
C31 C33-C35 = CMP-2000-05808-2: as C13 on sheet Power_Stage; Length: 2.01mm; Min Operating Temperature: -55°C; Number of Pins: 2; Width: 0.049inch; Height: 0.94mm; Max Operating Temperature: 125°C; RoHS Compliant: Yes; Depth: 1.25mm; Radiation Hardening: No; Case Code (Metric): 2012; Case/Package: 0805; Contact Plating: Tin; Mount: Surface Mount; Tolerance: 5%; Dielectric Material: Ceramic; Case Code (Imperial): 0805; Capacitance: 100nF; Dielectric: X7R; Voltage Rating: 50V; REACH SVHC: No SVHC; Thickness: 0.037inch; Voltage Rating (DC): 50V; Lead Free: Lead Free; Package Quantity: 1; Packaging: Tape and Reel; Voltage: 50V; Termination: SMD/SMT
C36 = CMP-2007-04361-2: as C18 on sheet Power_Stage; Series: -; Case Code (Imperial): 0805; Voltage Rating (DC): 50V; Dielectric: X7R; Voltage Rating: 50V; Lead Free: Lead Free; Max Operating Temperature: 125°C; Depth: 1.25mm; Termination: SMD/SMT; Number of Pins: 2; Dielectric Material: Ceramic; Capacitance: 10nF; Case/Package: 0805; Contact Plating: Tin; Mount: Surface Mount; Height: 0.71mm; Package Quantity: 1; Packaging: Tape and Reel; Construction: Flat; RoHS Compliant: Yes; Voltage: 50V; Case Code (Metric): 2012; REACH SVHC: No SVHC; Tolerance: 5%; Radiation Hardening: No; Width: 0.049inch; Thickness: 0.037inch; Length: 2.01mm; Min Operating Temperature: -55°C
J2 = TB001-500-02BE: Integrated Circuit; Manufacturer_Name: CUI Devices; Datasheet Link: https://datasheet.datasheetarchive.com/originals/distributors/Datasheets_SAMA/b931254781d34eecaec474c4ccd45807.pdf; Height: 12.9mm; Manufacturer_Part_Number: TB001-500-02BE; Mouser Part Number: 490-TB001-500-02BE; Mouser Price/Stock: https://www.mouser.co.uk/ProductDetail/CUI-Devices/TB001-500-02BE?qs=vLWxofP3U2zBBnHgU5u3DA%3D%3D; Arrow Part Number: TB001-500-02BE; Arrow Price/Stock: https://www.arrow.com/en/products/tb001-500-02be/cui-devices?region=nac
J6 J7 = 22-28-4020: as J4 on sheet Main_Power_Supply; MP: 22-28-4020; Purchase-URL: https://pricing.snapeda.com/search/part/22-28-4020/?ref=eda; Availability: In Stock; SnapEDA_Link: https://www.snapeda.com/parts/22-28-4020/Molex/view-part/?ref=snap; Package: None; Check_prices: https://www.snapeda.com/parts/22-28-4020/Molex/view-part/?ref=eda; Value: *; Price: None
Q6 = CMP-18400-000003-1: OPTOISO 5KV LINEAR PHVOLT 8DIPGW; Manufacturer: Broadcom; Standoff Height: 0.5mm; Min Current Transfer Ratio: 25%; Forward Current: 10mA; Forward Voltage: 1.6V; Isolation Voltage: 5000Vrms; Reverse Voltage: 2.5V; Max Current Transfer Ratio: 75%; Max Junction Temp: +125°C; Device Class L1: Optoelectronics; Device Class L3: unset; Ipc Land Pattern Name: DIP1100W48P254L1130H510Q8; Ambient Temperature Range Low: -55°C; Temperature Range High: +85°C; Device Class L2: Optocouplers; Package: 0; RoHS: TRUE; Octopart: https://octopart.com/hcnr200-500e-broadcom-71127619; Digikey Description: OPTOISO 5KV LINEAR PHVOLT 8DIPGW; ComponentLink2URL: https://docs.broadcom.com/docs/AV02-0886EN; Automotive: No; Ambient Temperature Range High: +100°C; Lead Free: Yes; Temperature Range Low: -40°C; Category: Trans; Manufacturer Part Number: HCNR200-500E; Temperature: -40°C to +85°C; ComponentLink2Description: Datasheet; Height: 5mm; Mouser Description: High Linearity Optocouplers 1 Ch 60mW 25mA
Q7 = CMP-1048-00413-1: General Purpose Transistor, PNP Silicon, 3-Pin SC-75, Pb-Free, Tape and Reel; Manufacturer: On Semiconductor; fT Min (MHz): 250; IC Continuous (A): -0.2; ComponentLink1URL: http://www.onsemi.com/; ComponentLink3Description: Package Specification; PackageDescription: 3-Pin Small Outline Transistor, Body 1.6 x 0.8 mm, Pitch 0.5 mm; ComponentLink1Description: Manufacturer URL; ComponentLink2Description: Datasheet; RoHS: TRUE; Packing: Tape and Reel; PackageVersion: Rev. F, 07/2005; PartNumber: MMBT3906TT1G; ComponentLink3URL: http://www.onsemi.com/pub_link/Collateral/463-01.PDF; PackageReference: SC-75-3-463-01; Mounting Technology: Surface Mount; Polarity: PNP; DatasheetVersion: Rev. 1; ComponentLink2URL: http://www.onsemi.cn/pub_link/Collateral/MMBT3906TT1-D.PDF
Q8 = CMP-1048-00631-1: General Purpose Transistor, NPN Silicon, 3-Pin SOT-23, Pb-Free, Tape and Reel; Manufacturer: On Semiconductor; IC Continuous (A): 0.2; fT Min (MHz): 300; ComponentLink2Description: Datasheet; Polarity: NPN; PackageDescription: 3-Pin Small Outline Transistor, Body 2.92 x 1.3 mm, Pitch 0.95 mm; ComponentLink2URL: http://www.onsemi.cn/pub_link/Collateral/MMBT3904LT1-D.PDF; DatasheetVersion: Rev. 12; Mounting Technology: Surface Mount; PartNumber: MMBT3904LT1G; ComponentLink1URL: http://www.onsemi.com/; ComponentLink3Description: Package Specification; ComponentLink1Description: Manufacturer URL; PackageVersion: Rev. AP, 11/2009; PackageReference: SOT-23-3-318-08; Packing: Tape and Reel; ComponentLink3URL: http://www.onsemi.cn/pub_link/Collateral/318-08.PDF; RoHS: TRUE
R23 R25 R26 R29 R30 = CMP-2000-00182-1: as R15 on sheet Power_Stage
R24 = CMP-2000-00318-1: Part Number: ERJ-3EKF2002V; Manufacturer: Panasonic
R27 = CMP-2000-00256-1: Part Number: ERJ-3EKF1500V; Manufacturer: Panasonic
R28 = CMP-2000-00544-1: Part Number: ERJ-3EKF5111V; Manufacturer: Panasonic
R31 R32 = RT0603BRE07250RL: Thin Film Resistors - SMD 250 ohm 0.1% 50 ppm High-Precision RT0603BRE07250RL; Manufacturer_Name: YAGEO; Datasheet Link: https://componentsearchengine.com/Datasheets/1/RT0603BRE07250RL.pdf; Height: 0.55mm; Manufacturer_Part_Number: RT0603BRE07250RL; Mouser Part Number: 603-RT0603BRE07250RL; Mouser Price/Stock: https://www.mouser.co.uk/ProductDetail/Yageo/RT0603BRE07250RL?qs=ABvmyp11Kkh0Zt9FcqbSOQ%3D%3D; Arrow Part Number: RT0603BRE07250RL; Arrow Price/Stock: https://www.arrow.com/en/products/rt0603bre07250rl/yageo; Value: 250R
R33 R43 R46 = CMP-2000-00180-1: Part Number: ERJ-3EKF1001V; Manufacturer: Panasonic
R34 R35 = CMP-2000-00640-1: Part Number: ERJ-3EKF7680V; Manufacturer: Panasonic
R36 = CMP-1659-00056-1: Chip Resistor, 1 MOhm, +/- 1%, 100 mW, -55 to 155 degC, 0603 (1608 Metric), RoHS, Tape and Reel; Voltage Rating (DC): 25 V; Tolerance: 20%; Case\Package: Radial; Capacitance: 1 mF; Min Operating Temperature: -40 degC; PackageDescription: 2-Pin Surface Mount Device, Body 1.6 x 0.8 mm; ComponentLink1Description: Manufacturer URL; Radiation Hardening: No; DatasheetVersion: Rev. 4, 02/2016; REACH SVHC: No SVHC; Length: 20 mm; Max Operating Temperature: 85 degC; Diameter: 10 mm; Packaging: Bulk; Package Quantity: 200; PackageReference: 0603; Mount: Through Hole; ComponentLink1URL: http://www.yageo.com/; ComponentLink2URL: http://www.yageo.com/documents/recent/PYu-RC_Group_51_RoHS_L_04.pdf; ComponentLink2Description: Datasheet; Width: 0 inch; Lead Pitch: 5 mm; RoHSCompliant: true; Voltage Rating: 25 V; Height: 20 mm
R37 = CMP-2000-00680-1: Manufacturer: Panasonic; Part Number: ERJ-3EKF9092V
R38 = CMP-1012-00785-2: Manufacturer: Panasonic; Part Number: ERJ-3EKF2803V
R39 R41 R42 R44 = CMP-1012-00623-3: Chip Resistor, 10 KOhm, +/- 1%, 0.1 W, -55 to 155 degC, 0603 (1608 Metric), RoHS, Tape and Reel; Manufacturer: Panasonic; Voltage Rating: 75V; Case\/Package: 0603; Power Rating: 100mW; Resistance: 10KOhm; Temperature Coefficient: 100ppm\/degreesC; Number of Pins: 2; Package Reference: 603; Depth: 0.8mm; Mount: SurfaceMount; Package Description: 2-Pin Surface Mount Device, Body 1.6 x 0.85 mm; Datasheet Version: 02/2017; Length: 1.6mm; Lead Free: LeadFree; Height: 0.45mm; Number of Terminations: 2; Max Power Dissipation: 100mW; Min Operating Temperature: -55degC; Datasheet URL: https://industrial.panasonic.com/cdbs/www-data/pdf/RDA0000/AOA0000C304.pdf; Termination: SMD/SMT; Case Code (Metric): 1608; Case Code (Imperial): 0603; Tolerance: 1%; Max Operating Temperature: 155degC; RoHSCompliant: true; Voltage Rating (DC): 75V; Radiation Hardening: No; Packaging: TapeandReel; Composition: ThickFilm; Mounting Technology: SurfaceMount; Manufacturer URL: http://www.panasonic.com/; Width: 0.031inch; REACH SVHC: NoSVHC; Contact Plating: Tin; Military Standard: Not; Package Quantity: 1
R40 = CMP-2000-00637-1: Part Number: ERJ-3EKF7502V; Manufacturer: Panasonic
R45 = CMP-2000-00537-2: RES SMD 499K OHM 1% 1/10W 0603; Voltage Rating: 75V; Max Power Dissipation: 100mW; Resistance: 499kR; Temperature Coefficient: 100ppm/°C; Voltage Rating (DC): 50V; Packaging: Tape and Reel; Termination: SMD/SMT; Tolerance: 1%; Size Code: 0603; Resistor Type: Thick Film; RoHS Compliant: Yes; Min Operating Temperature: -55°C; Power Rating: 100mW; Number of Terminations: 2; Width: 0.031inch; Package Quantity: 1; Length: 1.6mm; Contact Plating: Tin; Military Standard: Not; Case/Package: 0603; Case Code (Imperial): 0603; Construction: Rectangular; Series: ERJ; Height: 0.022inch; REACH SVHC: Yes; Depth: 0.8mm; Features: Automotive AEC-Q200; Resistance Tolerance: 1%; Max Operating Temperature: 155°C; Mount: Surface Mount; Case Code (Metric): 1608; Lead Free: Lead Free; Radiation Hardening: No
S1 S2 = 100SP1T1B1M2QEH: Switch; Manufacturer_Name: E-Switch; Datasheet Link: http://spec_sheets.e-switch.com/specs/ST110001.pdf; Height: 28mm; Manufacturer_Part_Number: 100SP1T1B1M2QEH; Mouser Part Number: 612-100-A1121; Mouser Price/Stock: https://www.mouser.co.uk/ProductDetail/E-Switch/100SP1T1B1M2QEH?qs=01kh3H%252BlXijQZiBNZaNcCA%3D%3D
U3 U7 = CMP-0384-01858-1: Quad Channel Rail-to-Rail Operational Amplifier, 3 MHz BW, 5 V/us SR, Industrial, 14-pin SOP (RU-14), Reel; Generic Part Number: AD8534; Manufacturer: Analog Devices; Input Offset Voltage: 25mV; V Span Min: 3V; Slew Rate: 5V/us; Iq/Amp: 1.25mA; Amplifiers Per Package: 4; Input Bias Current: 5pA; V Span Max: 6V; Small Signal Bandwidth: 3MHz; PartNumber: AD8534ARUZ-REEL; ComponentLink3Description: Package Specification; ComponentLink2URL: http://www.analog.com/static/imported-files/data_sheets/AD8531_8532_8534.pdf; ComponentLink2Description: Datasheet; Mounting Technology: Surface Mount; ComponentLink1Description: Manufacturer URL; DatasheetVersion: Rev. F; PackageReference: RU-14; ComponentLink3URL: http://www.analog.com/static/imported-files/packages/36057385283879153717235186773RU14.pdf; ComponentLink1URL: http://www.analog.com/en/index.html; PackageDescription: 14-Pin Thin Shrink Small Outline Package, Body 5 x 4.4 mm, Pitch 0.65 mm; Code_JEDEC: MO-153AB-1
U4 U5 = CMP-00252-66800125-1: LM4040CYM3-5.0-TR LM4040 Series 5 V ±0.5% Precision Micropower Shunt Voltage Reference-SOT-23-3; Cathode Current: 74µA; Reference Type: Fixed, Shunt; Temperature Coefficient: 100ppm/°C; Reference Voltage: 5V; Max Output Current: 15mA; Min Output Voltage: 4.75V; Number of Channels: 1; Nominal Supply Current: 500nA; Output Type: Fixed; Max Junction Temperature (Tj): 125°C; RoHS: Compliant; Length: 3.05mm; Case/Package: SOT-23; Height: 1.05mm; Output Current: 15mA; Width: 1.4mm; Current Rating: 15mA; NexarPartId: 66800125; Ambient Temperature Range High: 85°C; Tolerance: 0.5%; Min Operating Temperature: -40°C; Number of Pins: 3; Radiation Hardening: No; Lifecycle Status: Production; Number of Outputs: 1; Lead Free: Lead Free; Output Voltage: 5V; Max Operating Temperature: 85°C; Schedule B: 8542390000, 8542390000; Mount: Surface Mount; Max Output Voltage: 5V
U6 = CMP-09079-000050-1: IC OSC SILICON PROG 6-DFN; Max Supply Voltage: 5.5V; Frequency: 3.81Hz; Number of Timers/Counters: 1; Frequency Tolerance: 2.4%; Operating Supply Current: 365uA; Min Supply Voltage: 2.25V; Width: 2mm; Height: 0.75mm; Depth: 3mm; Packaging: Cut Tape; Min Operating Temperature: 0°C; Case/Package: DFN; Length: 2mm; Max Operating Temperature: 70°C; RoHS Compliant: Yes; Series: TimerBlox®; Number of Pins: 6; Package Quantity: 1; Mount: Surface Mount; Reach SVHC Compliant: Yes
VR2 = 3296W-1-203LF: Trimmer Resistors - Through Hole 3/8" 20Kohms Sealed Vertical Adjust; MF: {'manufacturer': u'Bourns'}; Package: None; Price: None; MP: 3296W-1-203LF; Availability: Unavailable

## Nets that join several sheets
GND: Power_Stage (32 pins), Main_Power_Supply (10 pins), FB_Control (14 pins)
ISO_GND: Main_Power_Supply (C21.1 L2.2), FB_Control (11 pins)
Vin: Power_Stage (13 pins), Main_Power_Supply (5 pins)
Viso: Main_Power_Supply (J4.2), FB_Control (C31.1 R27.1 R35.1 U3.4)
Vs: Main_Power_Supply (J5.2), FB_Control (6 pins)
NetJ7_2: Power_Stage (R7.2), FB_Control (J7.2)
NetR4_1: Power_Stage (R4.1 R8.2), FB_Control (U6.4)